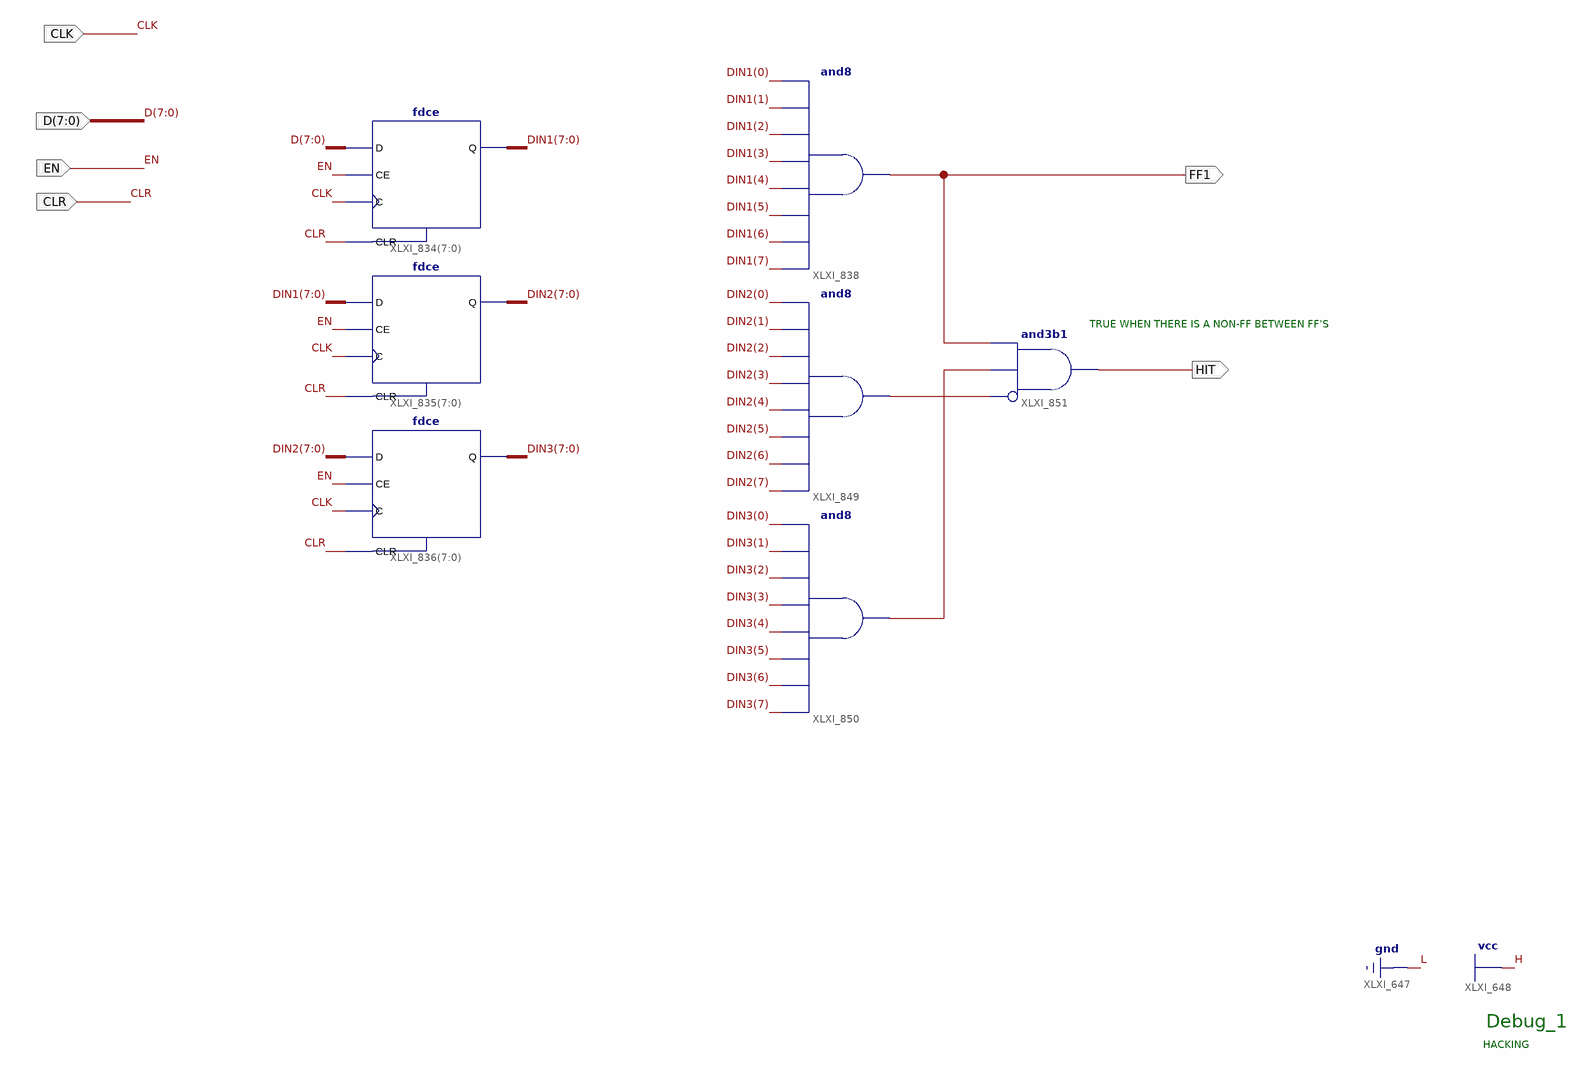
[diagram p0: schematic sheet 1]
// Xilinx ISE schematic Debug_1.sch (spartan3e) as structural Verilog: 7 symbols, 6 ports
module Debug_1 (
  input  CLK,
  input  EN,
  input  CLR,
  input  [7:0] D,
  output FF1,
  output HIT
);

  wire XLXN_147, XLXN_156;
  wire [7:0] DIN1, DIN2, DIN3;

  fdce XLXI_834[7:0] (.C(CLK), .CE(EN), .CLR(CLR), .D(D), .Q(DIN1));
  fdce XLXI_835[7:0] (.C(CLK), .CE(EN), .CLR(CLR), .D(DIN1), .Q(DIN2));
  fdce XLXI_836[7:0] (.C(CLK), .CE(EN), .CLR(CLR), .D(DIN2), .Q(DIN3));
  and XLXI_838 (FF1, DIN1[7], DIN1[6], DIN1[5], DIN1[4], DIN1[3], DIN1[2], DIN1[1], DIN1[0]);
  and XLXI_849 (XLXN_147, DIN2[7], DIN2[6], DIN2[5], DIN2[4], DIN2[3], DIN2[2], DIN2[1], DIN2[0]);
  and XLXI_850 (XLXN_156, DIN3[7], DIN3[6], DIN3[5], DIN3[4], DIN3[3], DIN3[2], DIN3[1], DIN3[0]);
  and XLXI_851 (HIT, ~XLXN_147, XLXN_156, FF1);  // and3b1

  // Notes on the sheet:
  //   TRUE WHEN THERE IS A NON-FF BETWEEN FF'S
  //   Debug_1
  //   HACKING
endmodule
